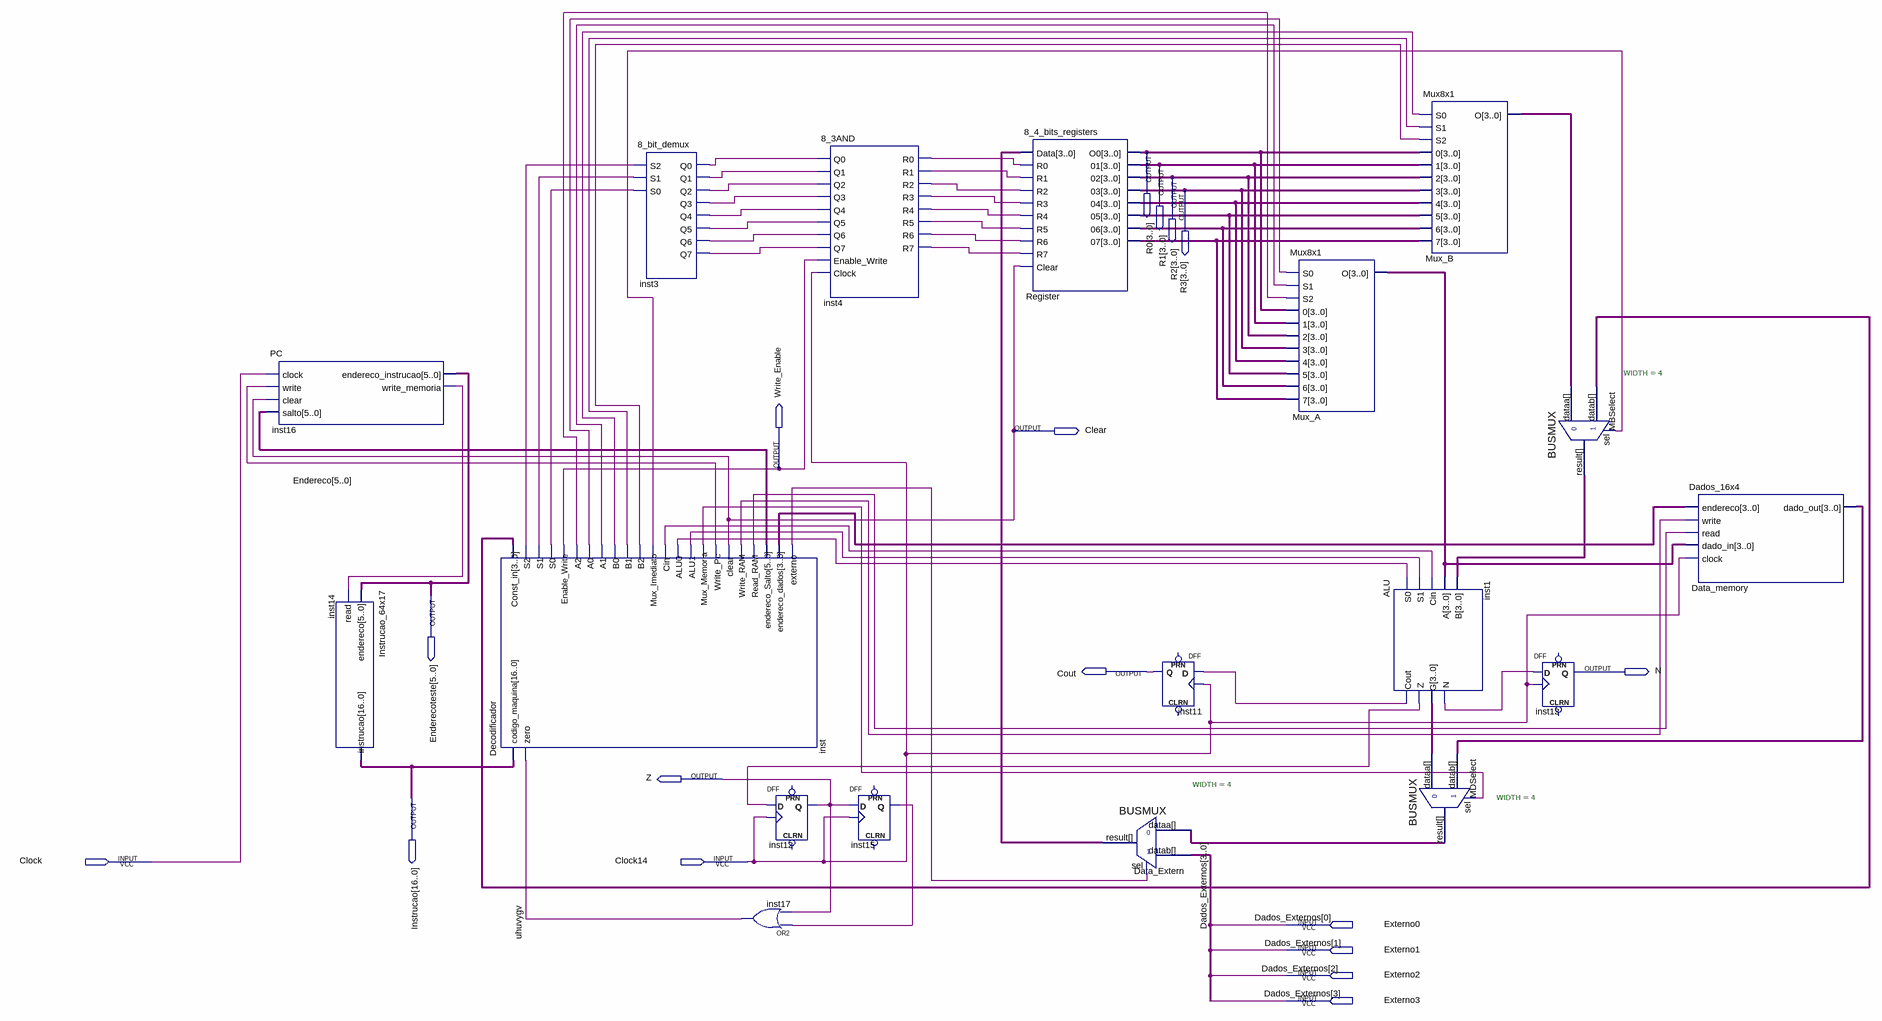
[diagram p0: schematic sheet]
// Quartus schematic ARQ_Lab1.bdf as structural Verilog: 18 symbols, 17 pins
module ARQ_Lab1 (
  input  Clock,
  input  Clock14,
  input  Externo0,
  input  Externo1,
  input  Externo2,
  input  Externo3,
  output [3:0] R0,
  output [3:0] R1,
  output [3:0] R2,
  output [3:0] R3,
  output Clear,
  output Write_Enable,
  output [5:0] Enderecoteste,
  output Cout,
  output N,
  output Z,
  output [16:0] Instrucao
);

  wire inst1_cout, inst1_n, inst1_z, inst3_q0, inst3_q1, inst3_q2, inst3_q3, inst3_q4, inst3_q5, inst3_q6,
       inst3_q7, inst4_r0, inst4_r1, inst4_r2, inst4_r3, inst4_r4, inst4_r5, inst4_r6, inst4_r7, inst15_q,
       inst16_write_memoria, inst_a0, inst_a1, inst_a2, inst_alu0, inst_alu1, inst_b0, inst_b1, inst_b2,
       inst_cin, inst_externo, inst_mux_imediato, inst_mux_memoria, inst_read_ram, inst_s0, inst_s1, inst_s2,
       inst_write_pc, inst_write_ram, uhuvygv;
  wire [3:0] Data_Extern_result, Data_memory_dado_out, inst1_g, inst_const_in, inst_endereco_dados,
       MBSelect_result, MDSelect_result, Mux_A_o, Mux_B_o, Register_04, Register_05, Register_06, Register_07;
  wire [5:0] Endereco;

  PC inst16 (
    .clock(Clock), .write(inst_write_pc), .clear(Clear), .salto(Endereco),
    .endereco_instrucao(Enderecoteste), .write_memoria(inst16_write_memoria));
  Instrucao_64x17 inst14 (.endereco(Enderecoteste), .read(inst16_write_memoria), .instrucao(Instrucao));
  Decodificador inst (
    .codigo_maquina(Instrucao), .zero(uhuvygv), .Const_in(inst_const_in), .S2(inst_s2), .S1(inst_s1),
    .S0(inst_s0), .Enable_Write(Write_Enable), .A2(inst_a2), .A0(inst_a0), .A1(inst_a1), .B0(inst_b0),
    .B1(inst_b1), .B2(inst_b2), .Mux_Imediato(inst_mux_imediato), .Cin(inst_cin), .ALU0(inst_alu0),
    .ALU1(inst_alu1), .Mux_Memoria(inst_mux_memoria), .Write_Pc(inst_write_pc), .clear(Clear),
    .Write_RAM(inst_write_ram), .Read_RAM(inst_read_ram), .endereco_Salto(Endereco),
    .endereco_dados(inst_endereco_dados), .externo(inst_externo));
  \8_bit_demux  inst3 (
    .S2(inst_s2), .S1(inst_s1), .S0(inst_s0), .Q0(inst3_q0), .Q1(inst3_q1), .Q2(inst3_q2), .Q3(inst3_q3),
    .Q4(inst3_q4), .Q5(inst3_q5), .Q6(inst3_q6), .Q7(inst3_q7));
  or inst17 (uhuvygv, inst15_q, Z);
  DFF inst12 (.CLK(Clock14), .D(inst1_z), .Q(Z));  // open: CLRN, PRN
  \8_3AND  inst4 (
    .Q0(inst3_q0), .Q1(inst3_q1), .Q2(inst3_q2), .Q3(inst3_q3), .Q4(inst3_q4), .Q5(inst3_q5), .Q6(inst3_q6),
    .Q7(inst3_q7), .Enable_Write(Write_Enable), .Clock(Clock14), .R0(inst4_r0), .R1(inst4_r1), .R2(inst4_r2),
    .R3(inst4_r3), .R4(inst4_r4), .R5(inst4_r5), .R6(inst4_r6), .R7(inst4_r7));
  DFF inst15 (.CLK(Clock14), .D(Z), .Q(inst15_q));  // open: CLRN, PRN
  \8_4_bits_registers  Register (
    .Data(Data_Extern_result), .R0(inst4_r0), .R1(inst4_r1), .R2(inst4_r2), .R3(inst4_r3), .R4(inst4_r4),
    .R5(inst4_r5), .R6(inst4_r6), .R7(inst4_r7), .Clear(Clear), .O0(R0), .\01 (R1), .\02 (R2), .\03 (R3),
    .\04 (Register_04), .\05 (Register_05), .\06 (Register_06), .\07 (Register_07));
  BUSMUX #(.WIDTH(4)) Data_Extern (
    .datab({Externo3, Externo2, Externo1, Externo0}), .sel(inst_externo), .dataa(MDSelect_result),
    .result(Data_Extern_result));
  DFF inst11 (.CLK(Clock14), .D(inst1_cout), .Q(Cout));  // open: CLRN, PRN
  Mux8x1 Mux_A (
    .S0(inst_a0), .S1(inst_a1), .S2(inst_a2), .\0 (R0), .\1 (R1), .\2 (R2), .\3 (R3), .\4 (Register_04),
    .\5 (Register_05), .\6 (Register_06), .\7 (Register_07), .O(Mux_A_o));
  ALU inst1 (
    .S0(inst_alu0), .S1(inst_alu1), .Cin(inst_cin), .A(Mux_A_o), .B(MBSelect_result), .Cout(inst1_cout),
    .Z(inst1_z), .G(inst1_g), .N(inst1_n));
  Mux8x1 Mux_B (
    .S0(inst_b0), .S1(inst_b1), .S2(inst_b2), .\0 (R0), .\1 (R1), .\2 (R2), .\3 (R3), .\4 (Register_04),
    .\5 (Register_05), .\6 (Register_06), .\7 (Register_07), .O(Mux_B_o));
  BUSMUX #(.WIDTH(4)) MDSelect (
    .datab(Data_memory_dado_out), .sel(inst_mux_memoria), .dataa(inst1_g), .result(MDSelect_result));
  BUSMUX #(.WIDTH(4)) MBSelect (
    .datab(inst_const_in), .sel(inst_mux_imediato), .dataa(Mux_B_o), .result(MBSelect_result));
  DFF inst13 (.CLK(Clock14), .D(inst1_n), .Q(N));  // open: CLRN, PRN
  Dados_16x4 Data_memory (
    .endereco(inst_endereco_dados), .write(inst_write_ram), .read(inst_read_ram), .dado_in(Mux_A_o),
    .clock(Clock14), .dado_out(Data_memory_dado_out));

  // Other names for the same wires on the sheet: Dados_Externos[3:0] = {Externo3, Externo2, Externo1, Externo0}
endmodule
